# Altium schematic sheet wifi.SchDoc
size A4
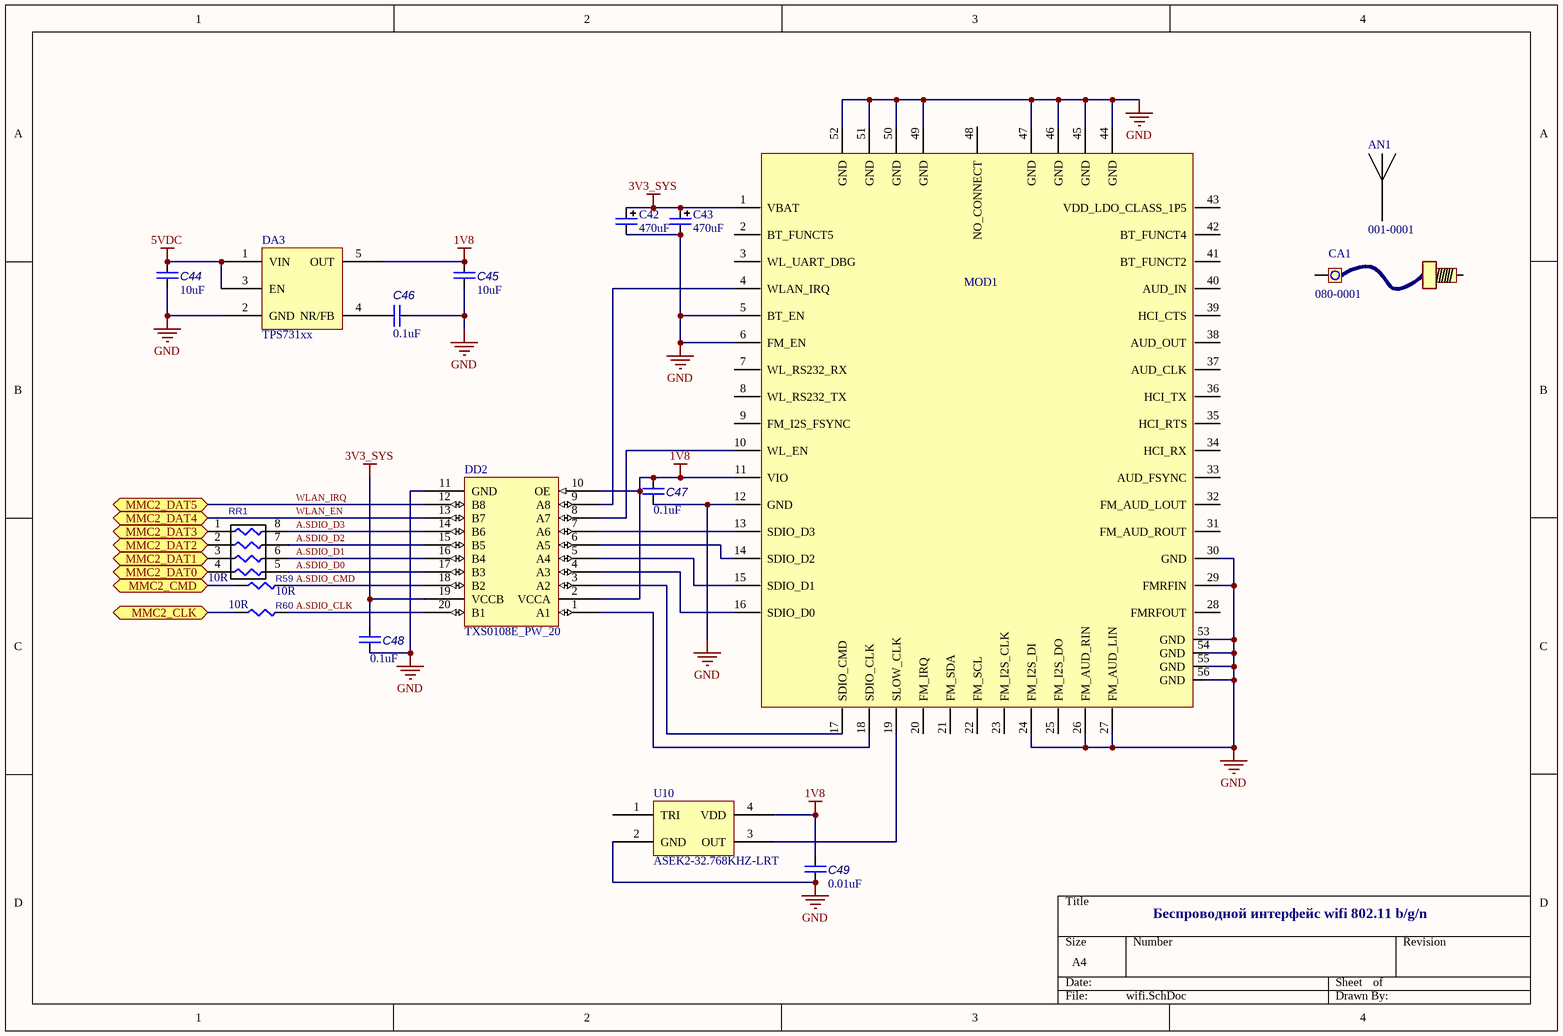
[diagram p0: wifi.SchDoc]

## Parts
AN1  P/N: 001-0001  (hidden comment: Antenna)
C42  value 470uF  [Cap_D]  (hidden comment: Cap_D)
C43  value 470uF  [Cap_D]  (hidden comment: Cap_D)
C44  value 10uF  [CC2012-0805]  (hidden comment: C0805)
C45  value 10uF  [CC2012-0805]  (hidden comment: C0805)
C46  value 0.1uF  [CC1608-0603]  (hidden comment: C0603)
C47  value 0.1uF  [CC1608-0603]  (hidden comment: C0603)
C48  value 0.1uF  [CC1608-0603]  (hidden comment: C0603)
C49  value 0.01uF  [CC1608-0603]  (hidden comment: C0603)
CA1  P/N: 080-0001  (hidden comment: Cable)
DA3  TPS731xx  [SOT95P280X145-5N]
DD2  TXS0108E_PW_20  [PW20]
MOD1  TIWI-R2_MODULE_UFL  [tiwi-r2]  (value not drawn)
R59  value 10R  [RESC1608X55N]  (hidden comment: R0603)
R60  value 10R  [RESC1608X55N]  (hidden comment: R0603)
RR1  value 10R  [CAY16-J4]  (hidden comment: CAY-J4)
U10  ASEK2-32.768KHZ-LRT  [asek1]

## Ports
MMC2_CLK, MMC2_CMD, MMC2_DAT0, MMC2_DAT1, MMC2_DAT2, MMC2_DAT3, MMC2_DAT4, MMC2_DAT5

## Nets
1V8: C45.2 C47.2 C49.1 DA3.5(OUT) DD2.2(VCCA) DD2.10(OE) MOD1.11(VIO) U10.4(VDD)
3V3_SYS: C42.1 C43.1 C48.2 DD2.19(VCCB) MOD1.1(VBAT)
5VDC: C44.2 DA3.1(VIN) DA3.3(EN)
GND: C42.2 C43.2 C44.1 C45.1 C46.1 C47.1 C48.1 C49.2 DA3.2(GND) DD2.11(GND) MOD1.5(BT_EN) MOD1.6(FM_EN) MOD1.12(GND) MOD1.24(FM_I2S_DI) MOD1.26(FM_AUD_RIN) MOD1.27(FM_AUD_LIN) MOD1.29(FMRFIN) MOD1.30(GND) MOD1.44(GND) MOD1.45(GND) MOD1.46(GND) MOD1.47(GND) MOD1.49(GND) MOD1.50(GND) MOD1.51(GND) MOD1.52(GND) MOD1.53(GND) MOD1.54(GND) MOD1.55(GND) MOD1.56(GND) U10.2(GND)
A.SDIO_CLK: DD2.20(B1) R60.2
A.SDIO_CMD: DD2.18(B2) R59.2
A.SDIO_D0: DD2.17(B3) RR1.5
A.SDIO_D1: DD2.16(B4) RR1.6
A.SDIO_D2: DD2.15(B5) RR1.7
A.SDIO_D3: DD2.14(B6) RR1.8
MMC2_CLK: R60.1 ; port MMC2_CLK
MMC2_CMD: R59.1 ; port MMC2_CMD
MMC2_DAT0: RR1.4 ; port MMC2_DAT0
MMC2_DAT1: RR1.3 ; port MMC2_DAT1
MMC2_DAT2: RR1.2 ; port MMC2_DAT2
MMC2_DAT3: RR1.1 ; port MMC2_DAT3
WLAN_EN: DD2.13(B7) ; port MMC2_DAT4
WLAN_IRQ: DD2.12(B8) ; port MMC2_DAT5
NetC46_2: C46.2 DA3.4(NR/FB)
NetDD2_1: DD2.1(A1) MOD1.18(SDIO_CLK)
NetDD2_3: DD2.3(A2) MOD1.17(SDIO_CMD)
NetDD2_4: DD2.4(A3) MOD1.16(SDIO_D0)
NetDD2_5: DD2.5(A4) MOD1.15(SDIO_D1)
NetDD2_6: DD2.6(A5) MOD1.14(SDIO_D2)
NetDD2_7: DD2.7(A6) MOD1.13(SDIO_D3)
NetDD2_8: DD2.8(A7) MOD1.10(WL_EN)
NetDD2_9: DD2.9(A8) MOD1.4(WLAN_IRQ)
NetMOD1_19: MOD1.19(SLOW_CLK) U10.3(OUT)

Not connected (* = marked no-connect by the designer): AN1 1; CA1 1 2; MOD1 2(BT_FUNCT5) 3(WL_UART_DBG) 7(WL_RS232_RX) 8(WL_RS232_TX) 9(FM_I2S_FSYNC) 20(FM_IRQ) 21(FM_SDA) 22(FM_SCL) 23(FM_I2S_CLK) 25(FM_I2S_DO) 28(FMRFOUT) 31(FM_AUD_ROUT) 32(FM_AUD_LOUT) 33(AUD_FSYNC) 34(HCI_RX) 35(HCI_RTS) 36(HCI_TX) 37(AUD_CLK) 38(AUD_OUT) 39(HCI_CTS) 40(AUD_IN) 41(BT_FUNCT2) 42(BT_FUNCT4) 43(VDD_LDO_CLASS_1P5) 48(NO_CONNECT); U10 1(TRI)

## Notes on the sheet
- Беспроводной интерфейс wifi 802.11 b/g/n

## Library data of the parts
C42 C43 = Cap_D: Tantalum Capacitor Case D; P/N: TR3D477M6R3C0200
CA1 = Cable: Wifi Cable
DA3 = TPS731xx: Cap-Free, NMOS, 150mA LDO; Manufacturer: TI; P/N: TPS73118DBVT
DD2 = TXS0108E_PW_20: Imported; Vendor: Texas Instruments; P/N: TXS0108EPWR; PACKAGE_DESIGNATOR: PW; PIN_COUNT: 20; FAMILY_NAME: AUTO DIRECTION SENSING DUAL SUPPLY TRANSLATOR; INDUSTRY_STD_PKG_TYPE: TSSOP; Manufacturer_Part_Number: txs0108e_pw_20; Datasheet URL: http://www.ti.com/lit/gpn/TXS0108E; Manufacturer: Texas Instruments; RefDes: RefDes; Type: DEV; Value: Value
MOD1 = TIWI-R2_MODULE_UFL: TiWi-R2 with u.fl Module; MANUFACTURER: LSR; Geometry.Height: 1.9mm; P/N: 450-0037; PCB DECAL: TIWI-R2_UFL
RR1 = CAY-J4: Resistor network 4x
U10 = ASEK2-32.768KHZ-LRT: 32.768KHZ 1.8V oscillator; Manufacturer: Abracon; P/N: ASEK2-32.768KHZ-LRT
C44 C45 = C0805: P/N: *
C46-C49 = C0603: P/N: *
R59 R60 = R0603: P/N: *